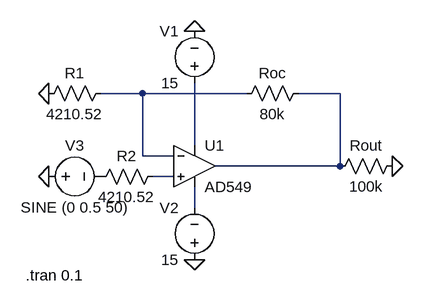
[diagram p0: schematic Draft2.asc]
Draft2.asc, the LTspice schematic file:
Version 4
SHEET 1 880 680
WIRE 144 48 80 48
WIRE 304 48 144 48
WIRE 448 48 384 48
WIRE 224 128 224 32
WIRE 144 144 144 48
WIRE 192 144 144 144
WIRE 448 160 448 48
WIRE 448 160 256 160
WIRE 192 176 160 176
WIRE 224 224 224 192
FLAG 528 160 0
FLAG 224 304 0
FLAG 0 176 0
FLAG 0 48 0
FLAG 224 -48 0
SYMBOL OpAmps\\AD549 224 96 R0
SYMATTR InstName U1
SYMBOL voltage 224 48 R180
WINDOW 0 24 96 Left 2
WINDOW 3 24 16 Left 2
SYMATTR InstName V1
SYMATTR Value 15
SYMBOL voltage 224 320 R180
WINDOW 0 24 96 Left 2
WINDOW 3 24 16 Left 2
SYMATTR InstName V2
SYMATTR Value 15
SYMBOL voltage -16 176 R270
WINDOW 0 32 56 VTop 2
WINDOW 3 -32 56 VBottom 2
SYMATTR InstName V3
SYMATTR Value SINE (0 0.5 50)
SYMBOL res 96 32 R90
WINDOW 0 0 56 VBottom 2
WINDOW 3 32 56 VTop 2
SYMATTR InstName R1
SYMATTR Value 4210.52
SYMBOL res 64 192 R270
WINDOW 0 32 56 VTop 2
WINDOW 3 0 56 VBottom 2
SYMATTR InstName R2
SYMATTR Value 4210.52
SYMBOL res 288 64 R270
WINDOW 0 32 56 VTop 2
WINDOW 3 0 56 VBottom 2
SYMATTR InstName Roc
SYMATTR Value 80k
SYMBOL res 432 176 R270
WINDOW 0 32 56 VTop 2
WINDOW 3 0 56 VBottom 2
SYMATTR InstName Rout
SYMATTR Value 100k
TEXT -36 328 Left 2 !.tran 0.1

The netlist it stands for:
* Draft2.asc
XU1 N004 N001 N003 N005 N002 AD549  ; pins In+ In- V+ V- OUT
V1 N003 0 15
V2 0 N005 15
V3 0 P001 SINE (0 0.5 50)
R1 N001 0 4210.52
R2 P001 N004 4210.52
Roc N001 N002 80k
Rout N002 0 100k
.tran 0.1
.backanno
.end